# Altium schematic sheet PoE_Injector.SchDoc: IEEE802.3AF/AT PSE Controller
size A3; SheetNumber: 5; SheetTotal: 9
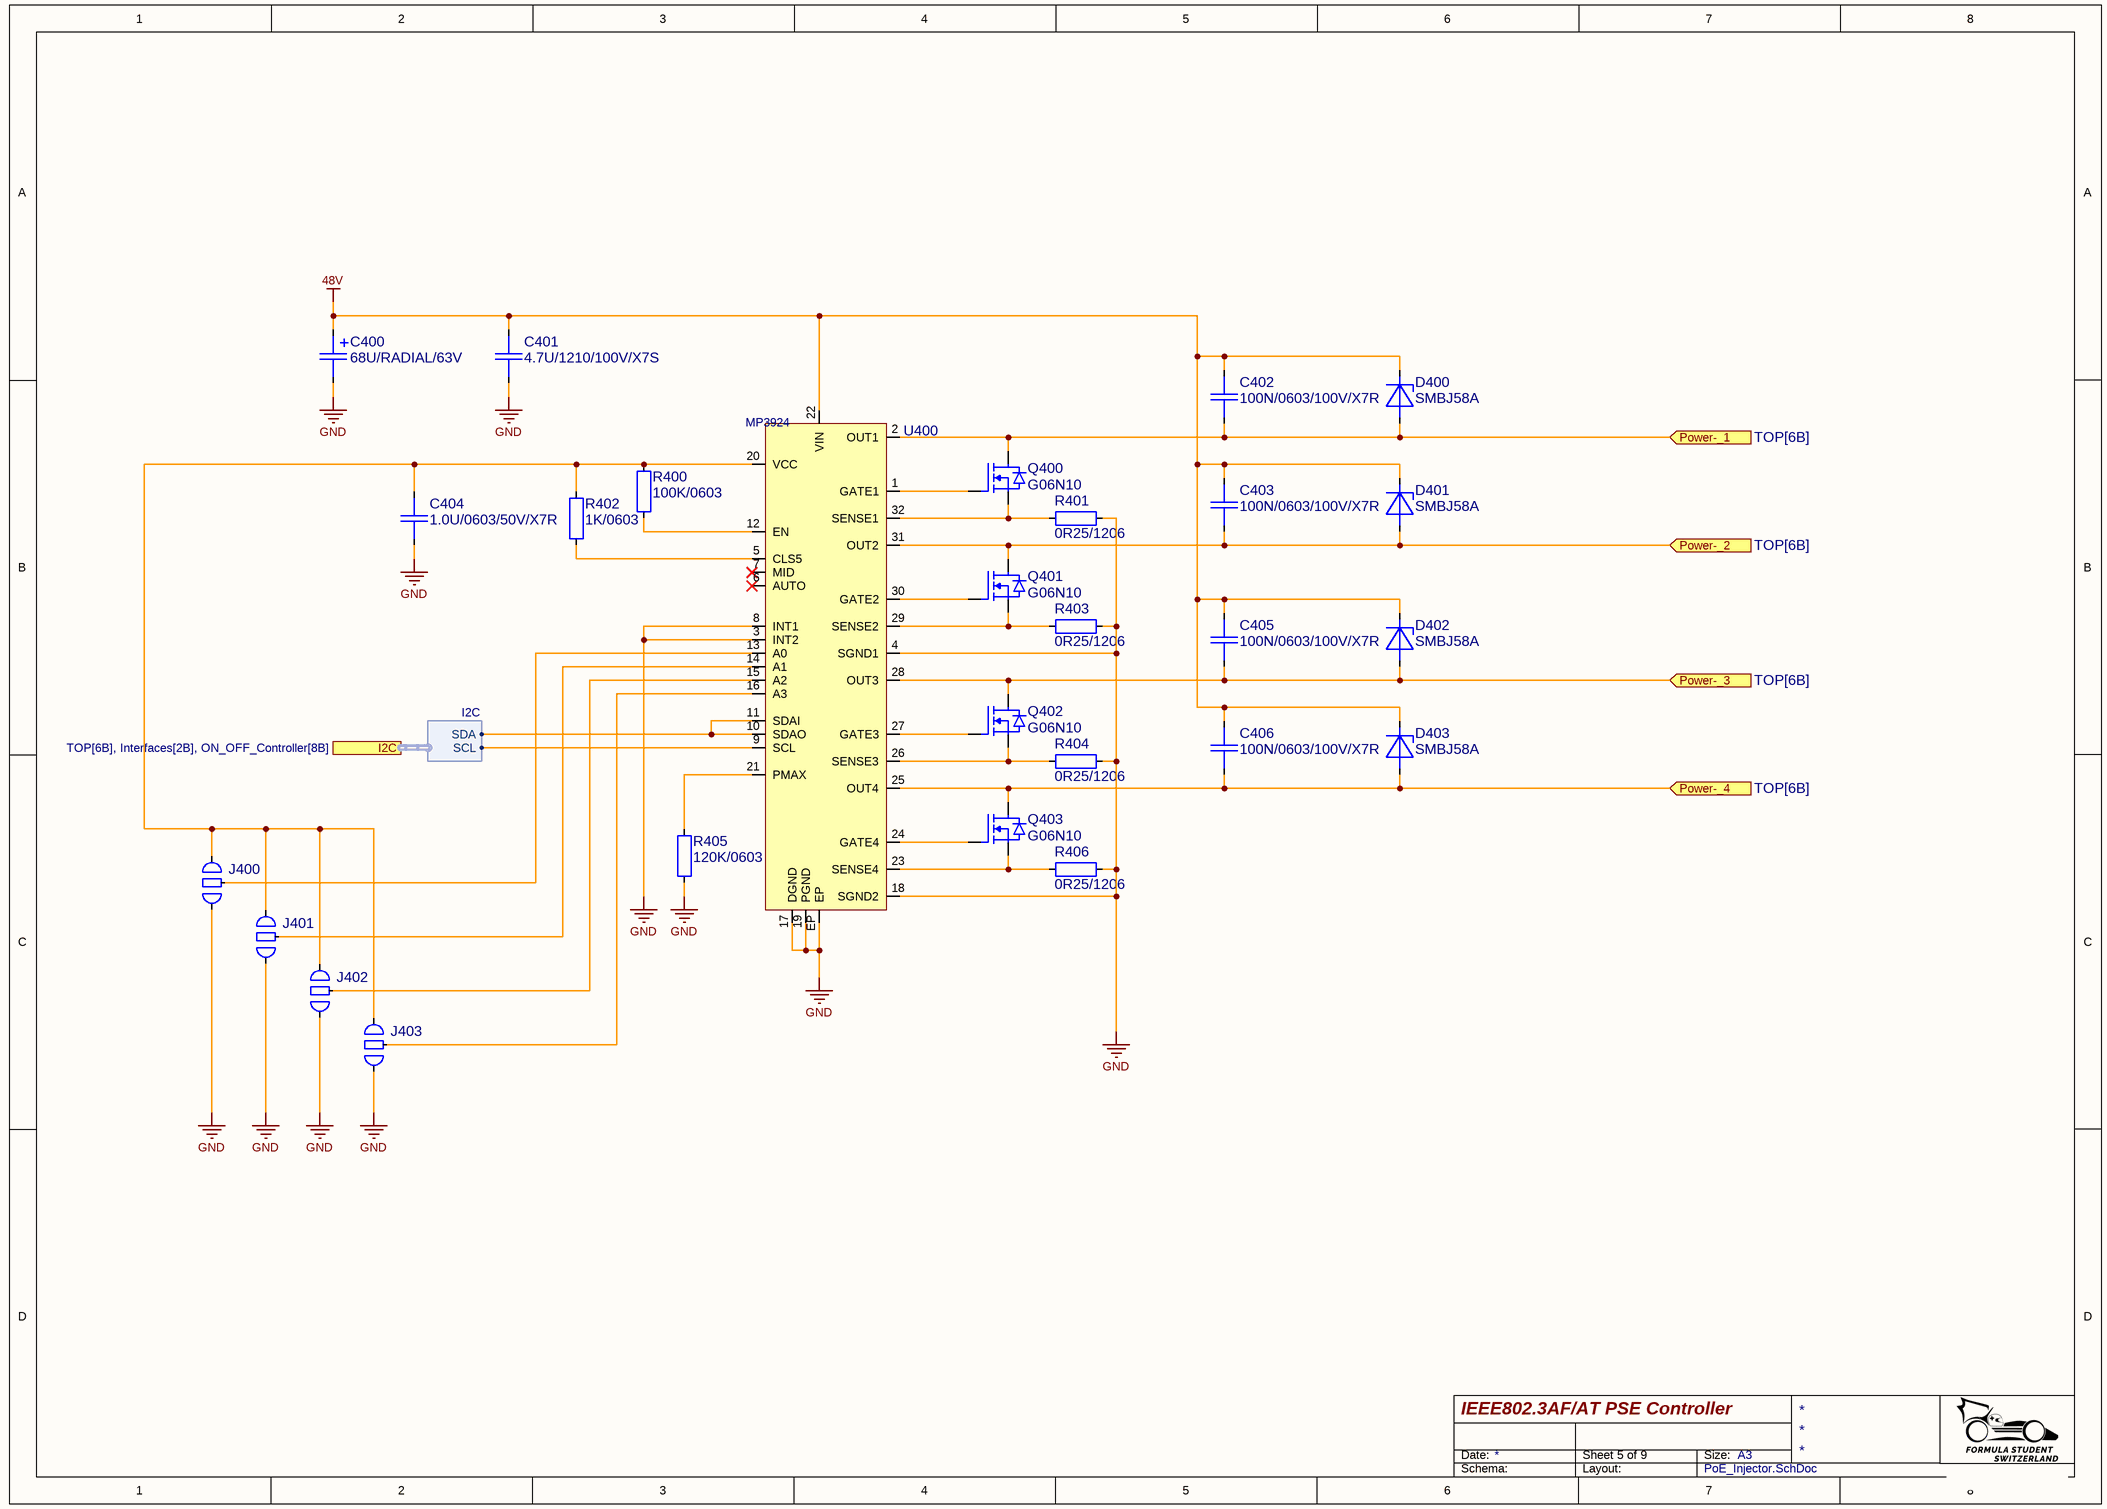
[diagram p0: PoE_Injector.SchDoc]

## Parts
C400  68U/RADIAL/63V  [CAP350P80X130]
C401  4.7U/1210/100V/X7S  [CAP1210_X7R]
C402  100N/0603/100V/X7R  [CAP0603_X7R]
C403  100N/0603/100V/X7R  [CAP0603_X7R]
C404  1.0U/0603/50V/X7R  [CAP0603_X7R]
C405  100N/0603/100V/X7R  [CAP0603_X7R]
C406  100N/0603/100V/X7R  [CAP0603_X7R]
D400  SMBJ58A  [DIOM5436X265]
D401  SMBJ58A  [DIOM5436X265]
D402  SMBJ58A  [DIOM5436X265]
D403  SMBJ58A  [DIOM5436X265]
J400  Solder Jumper 3pin 0.2mm  [Solder_Jumper_3pin_0.2mm]  (value not drawn)
J401  Solder Jumper 3pin 0.2mm  [Solder_Jumper_3pin_0.2mm]  (value not drawn)
J402  Solder Jumper 3pin 0.2mm  [Solder_Jumper_3pin_0.2mm]  (value not drawn)
J403  Solder Jumper 3pin 0.2mm  [Solder_Jumper_3pin_0.2mm]  (value not drawn)
Q400  G06N10  [TO228P990X229-3]
Q401  G06N10  [TO228P990X229-3]
Q402  G06N10  [TO228P990X229-3]
Q403  G06N10  [TO228P990X229-3]
R400  100K/0603  [R0603-0.40-WW]
R401  0R25/1206  [R1206-0.80-WW]
R402  1K/0603  [R0603-0.40-WW]
R403  0R25/1206  [R1206-0.80-WW]
R404  0R25/1206  [R1206-0.80-WW]
R405  120K/0603  [R0603-0.40-WW]
R406  0R25/1206  [R1206-0.80-WW]
U400  MP3924  [QFN050P500X500X100-32-TH360X360]

## Ports
I2C (harness I2C, see TOP[6B], Interfaces[2B], ON_OFF_Controller[8B]), Power-_1 (in, see TOP[6B]), Power-_2 (in, see TOP[6B]), Power-_3 (in, see TOP[6B]), Power-_4 (in, see TOP[6B])

## Harnesses
I2C: SCL, SDA

## Nets
48V: C400.1 C401.1 C402.1 C403.1 C405.1 C406.1 D400.1 D401.1 D402.1 D403.1 U400.22(VIN)
GND: C400.2 C401.2 C404.2 J400.1 J401.1 J402.1 J403.1 R401.2 R403.2 R404.2 R405.2 R406.2 U400.3(INT2) U400.4(SGND1) U400.8(INT1) U400.17(DGND) U400.18(SGND2) U400.19(PGND) U400.EP
Power-_1: C402.2 D400.2 Q400.3(DRAIN) U400.2(OUT1) ; port Power-_1
Power-_2: C403.2 D401.2 Q401.3(DRAIN) U400.31(OUT2) ; port Power-_2
Power-_3: C405.2 D402.2 Q402.3(DRAIN) U400.28(OUT3) ; port Power-_3
Power-_4: C406.2 D403.2 Q403.3(DRAIN) U400.25(OUT4) ; port Power-_4
NetC404_1: C404.1 J400.3 J401.3 J402.3 J403.3 R400.1 R402.1 U400.20(VCC)
NetJ400_2: J400.2 U400.13(A0)
NetJ401_2: J401.2 U400.14(A1)
NetJ402_2: J402.2 U400.15(A2)
NetJ403_2: J403.2 U400.16(A3)
NetQ400_1: Q400.1(GATE) U400.1(GATE1)
NetQ400_2: Q400.2(SOURCE) R401.1 U400.32(SENSE1)
NetQ401_1: Q401.1(GATE) U400.30(GATE2)
NetQ401_2: Q401.2(SOURCE) R403.1 U400.29(SENSE2)
NetQ402_1: Q402.1(GATE) U400.27(GATE3)
NetQ402_2: Q402.2(SOURCE) R404.1 U400.26(SENSE3)
NetQ403_1: Q403.1(GATE) U400.24(GATE4)
NetQ403_2: Q403.2(SOURCE) R406.1 U400.23(SENSE4)
NetR400_2: R400.2 U400.12(EN)
NetR402_2: R402.2 U400.5(CLS5)
NetR405_1: R405.1 U400.21(PMAX)
NetU400_9: U400.9(SCL) ; port I2C.SCL
NetU400_10: U400.10(SDAO) U400.11(SDAI) ; port I2C.SDA

Not connected (* = marked no-connect by the designer): U400 6(AUTO)* 7(MID)*

## Notes on the sheet
- Date:
- Size:
- A3
- Schema:
- Layout:

## Library data of the parts
C400 = 68U/RADIAL/63V: CAP THT 8C130 68UF ELKO 63V; Manufacturer: GENERIC; Manufacturer 1: Würth Elektronik; Manufacturer Part Number 1: 860020774014; Absolute Value: 6.8E-5; Part Number: 68U/RADIAL/63V; Package: RADIAL; Value: 68UF; HelpURL: https://www.we-online.com/components/products/datasheet/860020774014.pdf; Supplier 1: Digi-Key; Supplier Part Number 1: 732-8975-1-ND; Manufacturer Part Number 3: LKMD0901K680MF; Supplier 3: LCSC; Supplier Part Number 3: C443065
C401 = 4.7U/1210/100V/X7S: CAP SM 1210 4.7uF 100V X7S; Manufacturer: GENERIC; Manufacturer 1: Murata; Manufacturer Part Number 1: GRM31CC72A475ME11L; Absolute Value: 4.7E-6; Eurocircuits GPN: GPN1210475-100; Part Number: 4.7U/1210/100V/X7S; Package: 1210; Value: 4.7uF; HelpURL: https://search.murata.co.jp/Ceramy/image/img/A01X/G101/ENG/GRM31CC72A475ME11-01A.pdf; Supplier 1: Digi-Key; Supplier Part Number 1: 490-18621-1-ND; Manufacturer Part Number 3: CGA1210X7S475K101RT; Supplier 3: LCSC; Supplier Part Number 3: C6120041
C402 C403 C405 C406 = 100N/0603/100V/X7R: CAP SM 0603 100nF 100V X7R; Manufacturer: GENERIC; Manufacturer 1: Samsung Electro-Mechanics; Manufacturer Part Number 1: CL10B104KC8NNNC; Absolute Value: 2.2E-8; Eurocircuits GPN: GPC0603104-100; Part Number: 100N/0603/100V/X7R; Package: 0603; Value: 100nF; HelpURL: https://mm.digikey.com/Volume0/opasdata/d220001/medias/docus/1296/CL10B104KC8NNNC_Spec.pdf; Supplier 1: Digi-Key; Supplier Part Number 1: 1276-6807-1-ND; Manufacturer Part Number 3: CGA0603X7R104K101JT; Supplier 3: LCSC; Supplier Part Number 3: C6119850
C404 = 1.0U/0603/50V/X7R: CAP SM 0603 1.0uF 50V X7R; Manufacturer: GENERIC; Manufacturer 1: YAGEO; Manufacturer Part Number 1: CC0603KRX7R9BB105; Absolute Value: 1E-6; Eurocircuits GPN: GPC0603105; Part Number: 1.0U/0603/50V/X7R; Package: 0603; Value: 1.0uF; HelpURL: https://www.yageo.com/upload/media/product/app/datasheet/mlcc/upy-gphc_x7r_6_3v-to-250v.pdf; Supplier 1: Digi-Key; Supplier Part Number 1: 311-2082-1-ND
D400-D403 = SMBJ58A: TVS DIODE 58VWM 93.6VC DO214AA; Manufacturer: Littelfuse Inc.; Absolute Value: 58V; Part Number: SMBJ58A; Package: DO-214AA, SMB; Value: SMBJ58A; HelpURL: https://www.littelfuse.com/media?resourcetype=datasheets&itemid=09a6ae9a-73cb-4ac4-acac-e6dab92ab953&filename=littelfuse_tvs_diode_smbj_datasheet.pdf; Manufacturer 1: Littelfuse Inc.; Manufacturer Part Number 1: SMBJ58A; Supplier 1: Digi-Key; Supplier Part Number 1: SMBJ58ALFCT-ND
J400-J403 = Solder_Jumper_3pin_0.2mm: Solder jumper with three pins with a spacing of 0.2mm; Manufacturer: NONE; Part Number: Solder_Jumper_3pin_0.2mm
Q400-Q403 = G06N10: N100V,RD(MAX)<240M@10V,VTH1.2V~3; Manufacturer: Goford; Manufacturer 1: Goford Semiconductors; Part Number: G06N10; Package: TO-252; Manufacturer Part Number 1: G06N10; Supplier 1: Digi-Key; Supplier Part Number 1: 3141-G06N10CT-ND; Manufacturer 3: HL; Manufacturer Part Number 3: S12N10; Supplier 3: LCSC; Supplier Part Number 3: C19100370
R400 = 100K/0603: RES SM 0603 100K; Manufacturer: GENERIC; Manufacturer 1: YAGEO; Manufacturer Part Number 1: RC0603FR-13100KL; Absolute Value: 100000; Eurocircuits GPN: GPR0603100K; Part Number: 100K/0603; Package: 0603; Value: 100K; HelpURL: https://www.yageo.com/upload/media/product/productsearch/datasheet/rchip/PYu-RC_Group_51_RoHS_L_12.pdf; Supplier 1: Digi-Key; Supplier Part Number 1: 13-RC0603FR-13100KLCT-ND; Manufacturer 2: YAGEO; Manufacturer Part Number 2: RC0603FR-10100KL; Supplier 2: Digi-Key; Supplier Part Number 2: 13-RC0603FR-10100KLCT-ND; Manufacturer 3: UNI-ROYAL(Uniroyal Elec); Manufacturer Part Number 3: 0603WAF1003T5E; Supplier 3: LCSC; Supplier Part Number 3: C25803; JLC Type: Basic
R401 R403 R404 R406 = 0R25/1206: RES SM 1206 0R25; Manufacturer: GENERIC; Manufacturer 1: YAGEO; Manufacturer Part Number 1: RC1206FR-0715RL; Absolute Value: 0.25; Eurocircuits GPN: GPR12060R25; Part Number: 0R25/1206; Package: 1206; Value: 0R25; HelpURL: https://www.yageo.com/upload/media/product/app/datasheet/rchip/pyu-rl_group_521_rohs_l.pdf; Supplier 1: Digi-Key; Supplier Part Number 1: 311-.25LWCT-ND; Manufacturer 3: RALEC; Manufacturer Part Number 3: RLT06R25JTP; Supplier 3: LCSC; Supplier Part Number 3: C7500327
R402 = 1K/0603: RES SM 0603 1K; Manufacturer: GENERIC; Manufacturer 1: YAGEO; Manufacturer Part Number 1: RC0603FR-131KL; Absolute Value: 1000; Eurocircuits GPN: GPR06031K; Part Number: 1K/0603; Package: 0603; Value: 1K; HelpURL: https://www.yageo.com/upload/media/product/app/datasheet/rchip/pyu-rc_group_51_rohs_l.pdf; Supplier 1: Digi-Key; Supplier Part Number 1: 13-RC0603FR-131KLCT-ND; Manufacturer 2: YAGEO; Manufacturer Part Number 2: RC0603FR-101KL; Supplier 2: Digi-Key; Supplier Part Number 2: 13-RC0603FR-101KLCT-ND; Manufacturer 3: UNI-ROYAL(Uniroyal Elec); Manufacturer Part Number 3: 0603WAF1001T5E; Supplier 3: LCSC; Supplier Part Number 3: C21190; JLC Type: Basic
R405 = 120K/0603: RES SM 0603 120K; Manufacturer: GENERIC; Manufacturer 1: YAGEO; Manufacturer Part Number 1: RC0603FR-13120KL; Absolute Value: 120000; Eurocircuits GPN: GPR0603120K; Part Number: 120K/0603; Package: 0603; Value: 120K; HelpURL: https://www.yageo.com/upload/media/product/app/datasheet/rchip/pyu-rc_group_51_rohs_l.pdf; Supplier 1: Digi-Key; Supplier Part Number 1: 13-RC0603FR-13120KLCT-ND; Manufacturer 2: YAGEO; Manufacturer Part Number 2: RC0603FR-10120KL; Supplier 2: Digi-Key; Supplier Part Number 2: 13-RC0603FR-10120KLCT-ND
U400 = MP3924: Quad-Port, IEEE 802.3af/at PSE Controller for Power over Ethernet; Manufacturer: MPS; Manufacturer 1: Monolithic Power Systems Inc.; Manufacturer Part Number 1: MP3924GU-Z; Part Number: MP3924; Package: QFN-32; HelpURL: https://www.monolithicpower.com/en/documentview/productdocument/index/version/2/document_type/Datasheet/lang/en/sku/MP3924GU/document_id/9919/; Supplier 1: Digi-Key; Supplier Part Number 1: 1589-MP3924GU-ZCT-ND